# EAGLE design orbC (EAGLE 5.11)
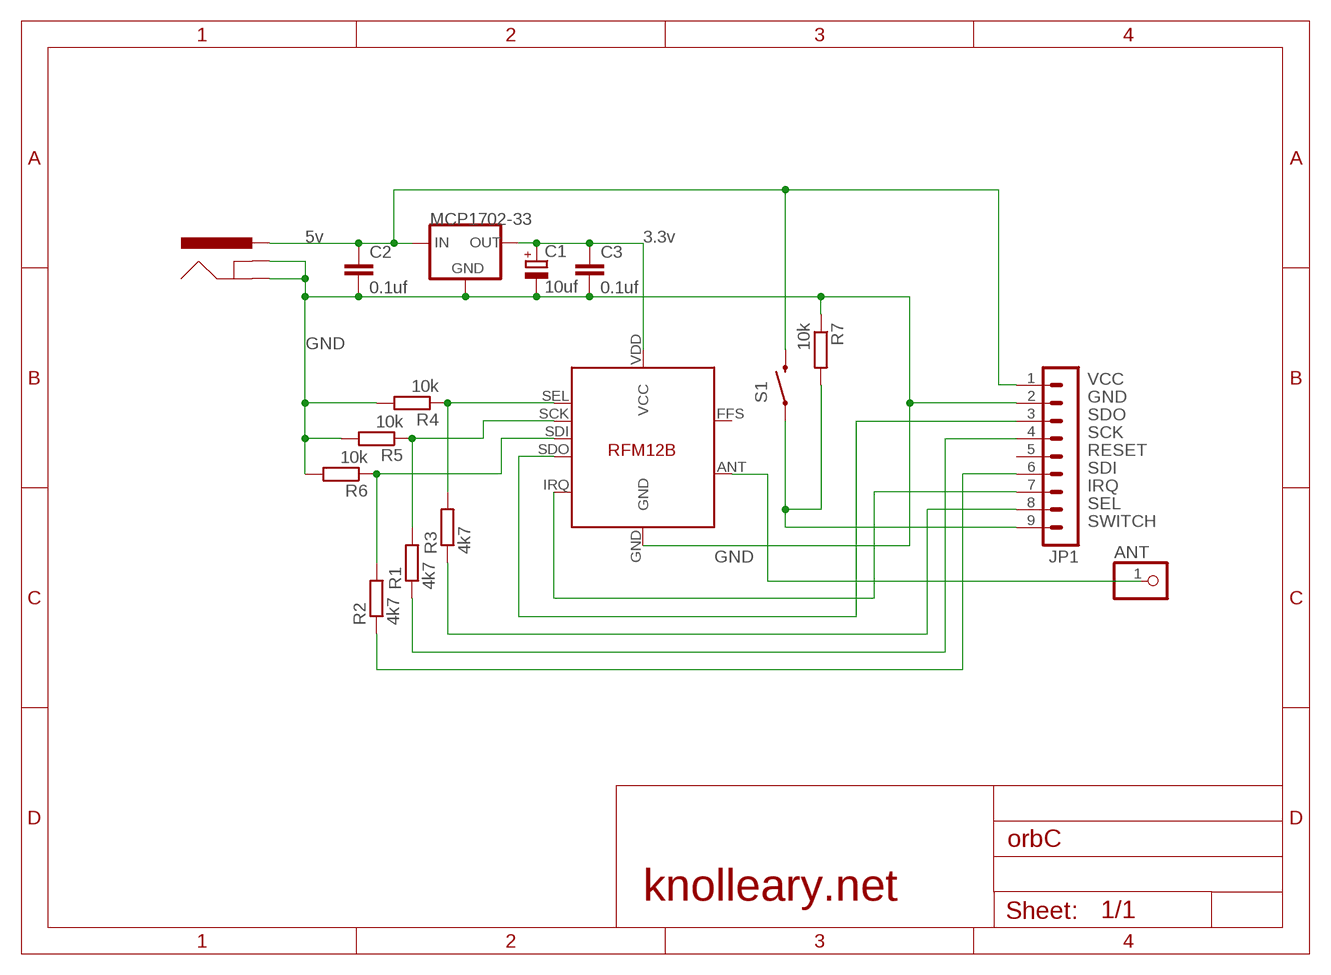
[diagram p0: schematic, sheet 1]

## Parts
ANT  PINHD-1X1  [1X01]
C1  10uf  CPOL-EUE2.5-5  [E2,5-5]
C2  0.1uf  C-EU025-025X050  [C025-025X050]
C3  0.1uf  C-EU025-025X050  [C025-025X050]
J2  POWER_JACKPTH  [POWER_JACK_PTH]
JP1  MA09-1  [MA09-1]
MCP1702-33  MCP1702  [78LXX]
R1  4k7  R-EU_0204/7  [0204/7]
R2  4k7  R-EU_0204/7  [0204/7]
R3  4k7  R-EU_0204/7  [0204/7]
R4  10k  R-EU_0204/7  [0204/7]
R5  10k  R-EU_0204/7  [0204/7]
R6  10k  R-EU_0204/7  [0204/7]
R7  10k  R-EU_0204/7  [0204/7]
S1  SWITCH-MOMENTARY-2-SMD-1101NE  [TACTILE-SWITCH-1101NE]
U$1  RFM12B  [RFM12B]

## Nets
GND: C1.- C2.2 C3.2 J2.GND J2.GNDBREAK JP1.2 MCP1702-33.GND R4.2 R5.2 R6.2 R7.1 U$1.GND
N$1: JP1.9 R7.2 S1.P$1
N$4: ANT.1 U$1.ANT
N$5: JP1.3 U$1.SDO
N$6: R1.2 R5.1 U$1.SCK
N$7: R2.2 R6.1 U$1.SDI
N$9: R3.2 R4.1 U$1.SEL
N$10: JP1.7 U$1.IRQ
N$13: JP1.8 R3.1
N$14: JP1.4 R1.1
N$15: JP1.6 R2.1
VCC: C1.+ C3.1 MCP1702-33.OUT U$1.VDD(VCC)
VCC5: C2.1 J2.PWR JP1.1 MCP1702-33.IN S1.P$2
Unconnected: JP1.5 U$1.FFS

## Notes on the sheet
- 5v | 3.3v
- GND
- VCC
- GND
- SDO
- SCK
- RESET
- SDI
- IRQ
- SEL
- SWITCH

## Library data of the parts
ANT = pinhead:PINHD-1X1: PIN HEADER
C1 = resistor:CPOL-EU: POLARIZED CAPACITOR, European symbol
C2 C3 = rcl:C-EU: CAPACITOR, European symbol
J2 = SparkFun:POWER_JACK: Power Jack This is the standard 5.5mm barrel jack for power. The PTH is the most common, proven, reliable, footprint. All others are experimental. The Slot footprint only works if the mill layer is transmitted to the PCB fab house so be warned. Spark Fun Electronics SKU : PRT-00119. Mating wall wart : TOL-00298 (and others)
JP1 = con-lstb:MA09-1: PIN HEADER; OC_FARNELL: unknown; OC_NEWARK: unknown
MCP1702-33 = knolleary:MCP1702: VOLTAGE REGULATOR
R1-R7 = resistor:R-EU_: RESISTOR, European symbol
S1 = SparkFun:SWITCH-MOMENTARY-2
U$1 = JeeParts:RFM12B

## Board
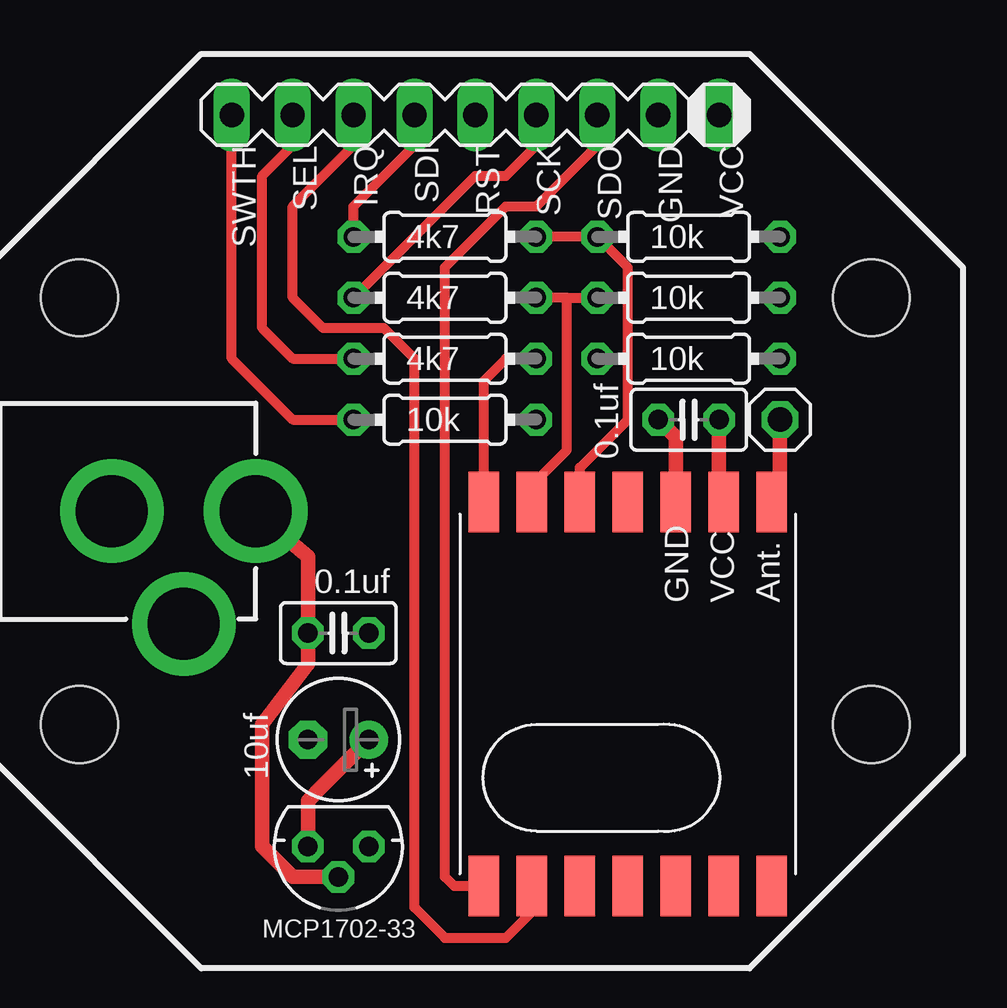
[diagram p1: board, top side]
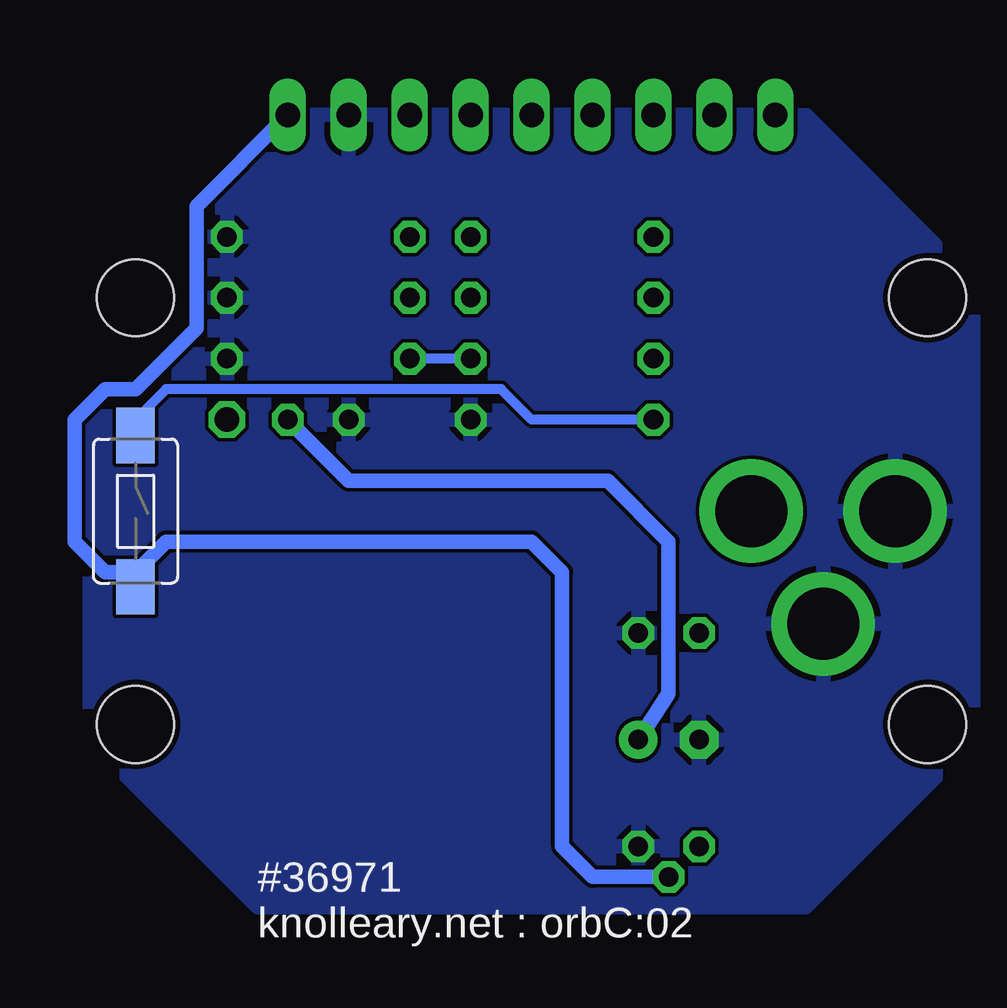
[diagram p2: board, bottom side, seen from below]

No outline drawn. Coordinates in mm, seen from the top.
Copper layers (1*16): Top 0.035mm / dielectric 1.5mm / Bottom 0.035mm
Design rules "Fusion_eagle_rule_v1.1": minimum track width 6mil, minimum drill 12mil, track to track 6mil, track to pad 6mil, pad to pad 6mil, via to via 6mil, smd to smd 0mil, copper to edge 10mil, drill to drill 10mil, minimum pad ring 10mil, minimum via ring 6mil, stop-mask expansion 2mil, vias tented up to drill 100mil, thermal gap 10mil
Holes 3.2 mm at 3.81,27.94 3.81,10.16 36.83,10.16 36.83,27.94

### Footprints (pad centres in the part's own frame; a part is rotated, then mirrored left to right if it is on the bottom)
1X01 = drill 1.016 octagon: 1 0,0
E2,5-5 = drill 0.813 pad 1.6 round: + -1.27,0 | drill 0.813 pad 1.6 octagon: - 1.27,0
C025-025X050 = drill 0.813 octagon: 1 -1.27,0; 2 1.27,0
POWER_JACK_PTH = drill 2.997 pad 4.318 round: GND 0,7.7; GNDBREAK 4.7,10.7; PWR 0,13.7
MA09-1 = drill 1.016 long: 1 -10.16,0; 2 -7.62,0; 3 -5.08,0; 4 -2.54,0; 5 0,0; 6 2.54,0; 7 5.08,0; 8 7.62,0; 9 10.16,0
78LXX = drill 0.813 octagon: GND -1.27,0; IN 0,1.27; OUT 1.27,0
0204/7 = drill 0.813 octagon: 1 -3.81,0; 2 3.81,0
TACTILE-SWITCH-1101NE = smd 2.3 x 1.6: P$1 -3.15,0; P$2 3.15,0
RFM12B = smd 2.54 x 1.27: ANT 8,-6; FFS -8,2; GND 8,-2; IRQ -8,4; P$8 -8,0; P$9 -8,-2; P$10 -8,-4; P$12 -8,-6; P$16 8,0; SCK 8,4; SDI 8,2; SDO -8,6; SEL 8,6; VDD 8,-4

### Placement (x,y rotation side)
ANT  33.02,22.86 0 top
C1  14.61,9.53 180 top
C2  14.61,13.97 0 top
C3  29.21,22.86 180 top
J2  -2.54,19.05 270 top
JP1  20.32,35.56 180 top
MCP1702-33  14.61,5.08 180 top
R1  19.05,27.94 0 top
R2  19.05,30.48 0 top
R3  19.05,25.4 0 top
R4  29.21,25.4 0 top
R5  29.21,27.94 0 top
R6  29.21,30.48 0 top
R7  19.05,22.86 180 top
S1  36.83,19.05 270 bottom
U$1  26.67,11.43 90 top

### Tracks (layer width: path | path; a pad name or v marks a point on that pad's centre or on a via)
GND
  Top 0.61: U$1.GND 28.67,22.13 C3.2
  pour Bottom: 8.89,35.56 1.91,28.57 1.91,9.53 8.89,2.54 31.75,2.54 38.73,9.53 38.73,28.57 31.75,35.56
N$1
  Top 0.406: R7.2 12.7,22.86 10.16,25.4 JP1.9
  Bottom 0.406: R7.2 20.32,22.86 21.59,24.13 35.56,24.13 36.83,22.86 S1.P$1
N$4
  Top 0.61: U$1.ANT 32.67,19.97 33.02,20.32 ANT.1
N$5
  Top 0.406: U$1.SDO 19.43,3.43 19.05,3.81 19.05,29.21 21.59,31.75 22.86,31.75 25.4,34.29 JP1.3
N$6
  Top 0.406: 24.13,27.94 R1.2 | 24.13,27.94 R5.1 | U$1.SCK 22.86,19.62 22.86,20.32 24.13,21.59 24.13,27.94
N$7
  Top 0.406: R2.2 R6.1 26.67,29.21 26.67,22.86 24.67,20.86 U$1.SDI
N$9
  Top 0.406: U$1.SEL 20.67,24.48 21.59,25.4 R3.2
  Bottom 0.406: R3.2 R4.1
N$10
  Top 0.406: JP1.7 15.24,34.29 12.7,31.75 12.7,27.94 13.97,26.67 16.51,26.67 17.78,25.4 17.78,2.54 19.05,1.27 21.59,1.27 22.86,2.54 22.86,3.24 U$1.IRQ
N$13
  Top 0.406: R3.1 12.7,25.4 11.43,26.67 11.43,33.02 12.7,34.29 JP1.8
N$14
  Top 0.406: R1.1 20.32,33.02 21.59,33.02 22.86,34.29 JP1.4
N$15
  Top 0.406: R2.1 15.24,31.75 17.78,34.29 JP1.6
VCC
  Top 0.61: C3.1 30.48,19.62 U$1.VDD | MCP1702-33.OUT 13.34,6.99 13.97,7.62 C1.+
  Bottom 0.61: C3.1 27.94,20.32 17.14,20.32 14.61,17.78 14.61,11.43 C1.+
VCC5
  Top 0.61: J2.PWR 11.43,18.78 13.34,17.14 C2.1 13.34,12.7 11.43,10.16 11.43,5.08 12.7,3.81 MCP1702-33.IN
  Bottom 0.61: JP1.1 34.29,31.75 34.29,26.67 36.83,24.13 38.1,24.13 39.37,22.86 39.37,17.78 38.1,16.51 36.83,16.51 | 36.83,16.51 35.56,17.78 20.32,17.78 19.05,16.51 19.05,5.08 17.78,3.81 MCP1702-33.IN | 36.83,16.51 S1.P$2

### Text on the board
tPlace: SWTH | SEL | IRQ | SDI | RST | SCK | SDO | GND | VCC
bPlace: #36971 | knolleary.net : orbC:02